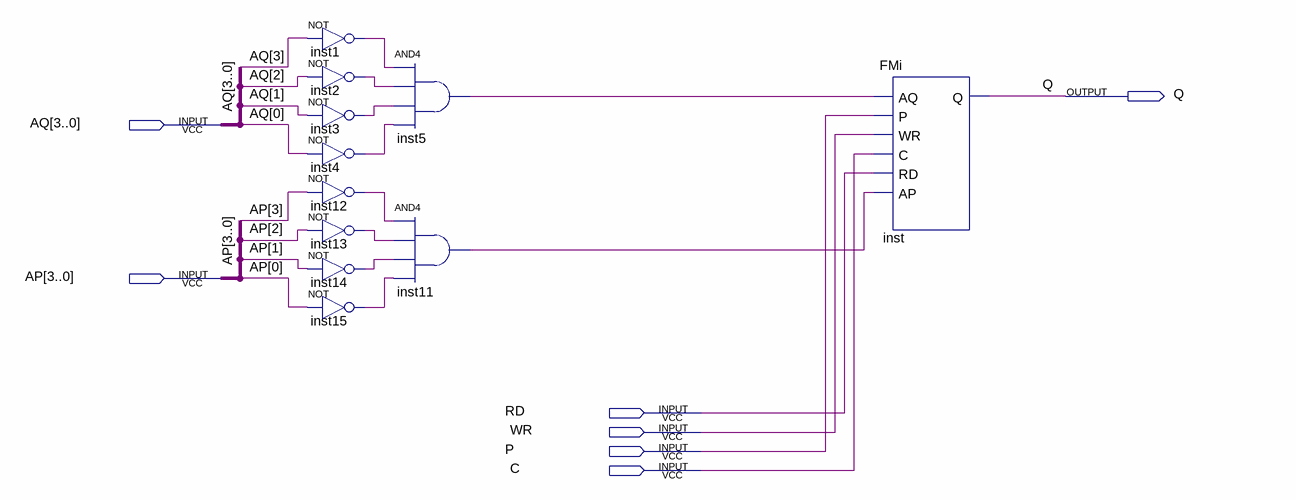
[diagram p0: schematic sheet]
// Quartus schematic FM0000.bdf as structural Verilog: 11 symbols, 7 pins
module FM0000 (
  input  [3:0] AQ,
  input  [3:0] AP,
  input  RD,
  input  WR,
  input  P,
  input  C,
  output Q
);

  wire inst1_out, inst2_out, inst3_out, inst4_out, inst5_out, inst11_out, inst12_out, inst13_out, inst14_out,
       inst15_out;

  not inst1 (inst1_out, AQ[3]);
  not inst2 (inst2_out, AQ[2]);
  not inst3 (inst3_out, AQ[1]);
  not inst4 (inst4_out, AQ[0]);
  not inst12 (inst12_out, AP[3]);
  not inst13 (inst13_out, AP[2]);
  not inst14 (inst14_out, AP[1]);
  not inst15 (inst15_out, AP[0]);
  and inst5 (inst5_out, inst1_out, inst2_out, inst3_out, inst4_out);
  and inst11 (inst11_out, inst12_out, inst13_out, inst14_out, inst15_out);
  FMi inst (.AQ(inst5_out), .P(P), .WR(WR), .C(C), .RD(RD), .AP(inst11_out), .Q(Q));
endmodule
